# Altium schematic sheet cube.SchDoc
size A4
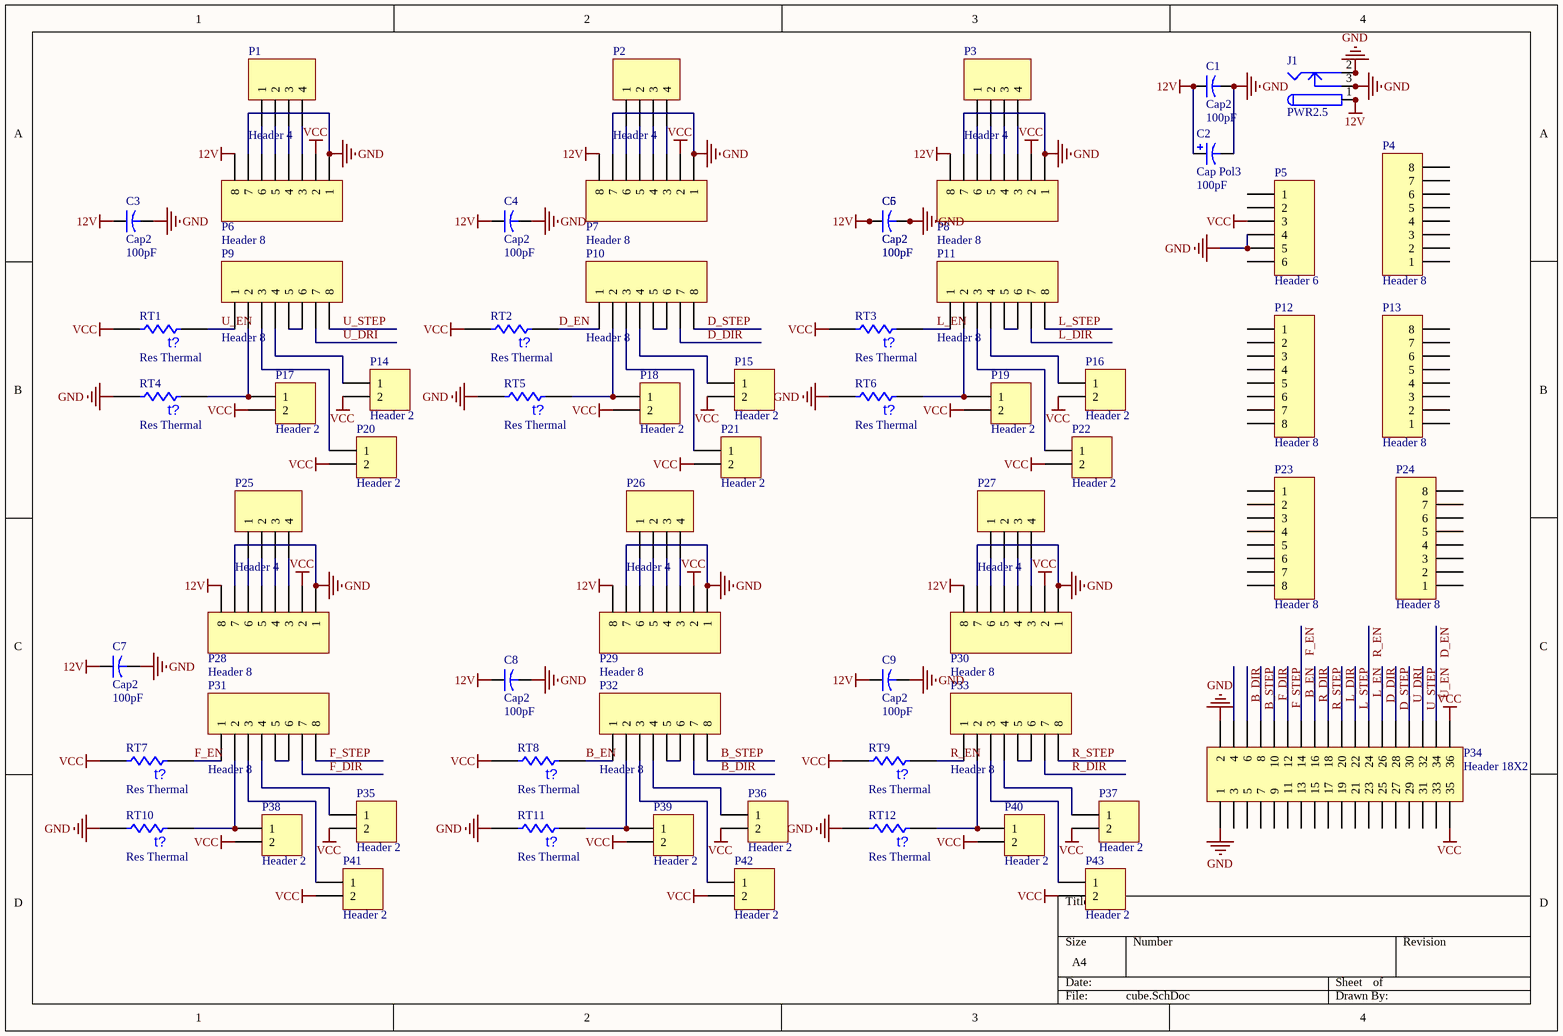
[diagram p0: cube.SchDoc]

## Parts
C1  Cap2  value 100pF  [CAPR5-4X5]
C2  Cap Pol3  value 100pF  [1812]
C3  Cap2  value 100pF  [CAPR5-4X5]
C4  Cap2  value 100pF  [CAPR5-4X5]
C5  Cap2  value 100pF  [CAPR5-4X5]
C6  Cap2  value 100pF  [CAPR5-4X5]
C7  Cap2  value 100pF  [CAPR5-4X5]
C8  Cap2  value 100pF  [CAPR5-4X5]
C9  Cap2  value 100pF  [CAPR5-4X5]
J1  PWR2.5  [KLD-0202]
P1  Header 4  [HDR1X4]
P2  Header 4  [HDR1X4]
P3  Header 4  [HDR1X4]
P4  Header 8  [HDR1X8]
P5  Header 6  [HDR1X6]
P6  Header 8  [HDR1X8]
P7  Header 8  [HDR1X8]
P8  Header 8  [HDR1X8]
P9  Header 8  [HDR1X8]
P10  Header 8  [HDR1X8]
P11  Header 8  [HDR1X8]
P12  Header 8  [HDR1X8]
P13  Header 8  [HDR1X8]
P14  Header 2  [HDR1X2]
P15  Header 2  [HDR1X2]
P16  Header 2  [HDR1X2]
P17  Header 2  [HDR1X2]
P18  Header 2  [HDR1X2]
P19  Header 2  [HDR1X2]
P20  Header 2  [HDR1X2]
P21  Header 2  [HDR1X2]
P22  Header 2  [HDR1X2]
P23  Header 8  [HDR1X8]
P24  Header 8  [HDR1X8]
P25  Header 4  [HDR1X4]
P26  Header 4  [HDR1X4]
P27  Header 4  [HDR1X4]
P28  Header 8  [HDR1X8]
P29  Header 8  [HDR1X8]
P30  Header 8  [HDR1X8]
P31  Header 8  [HDR1X8]
P32  Header 8  [HDR1X8]
P33  Header 8  [HDR1X8]
P34  Header 18X2  [HDR2X18]
P35  Header 2  [HDR1X2]
P36  Header 2  [HDR1X2]
P37  Header 2  [HDR1X2]
P38  Header 2  [HDR1X2]
P39  Header 2  [HDR1X2]
P40  Header 2  [HDR1X2]
P41  Header 2  [HDR1X2]
P42  Header 2  [HDR1X2]
P43  Header 2  [HDR1X2]
RT1  Res Thermal  [6-0805_L]
RT2  Res Thermal  [6-0805_L]
RT3  Res Thermal  [6-0805_L]
RT4  Res Thermal  [6-0805_L]
RT5  Res Thermal  [6-0805_L]
RT6  Res Thermal  [6-0805_L]
RT7  Res Thermal  [6-0805_L]
RT8  Res Thermal  [6-0805_L]
RT9  Res Thermal  [6-0805_L]
RT10  Res Thermal  [6-0805_L]
RT11  Res Thermal  [6-0805_L]
RT12  Res Thermal  [6-0805_L]

## Nets
12V: C1.1 C2.1 C3.1 C4.1 C5.1 C6.1 C7.1 C8.1 C9.1 J1.1 J1.1A J1.1B P6.8 P7.8 P8.8 P28.8 P29.8 P30.8
GND: C1.2 C2.2 C3.2 C4.2 C5.2 C6.2 C7.2 C8.2 C9.2 J1.2 J1.2A J1.2B J1.3 J1.3A J1.3B P5.4 P5.5 P6.1 P6.7 P7.1 P7.7 P8.1 P8.7 P28.1 P28.7 P29.1 P29.7 P30.1 P30.7 P34.1 P34.2 RT4.2 RT5.2 RT6.2 RT10.2 RT11.2 RT12.2
VCC: P5.3 P6.2 P7.2 P8.2 P14.2 P15.2 P16.2 P17.2 P18.2 P19.2 P20.2 P21.2 P22.2 P28.2 P29.2 P30.2 P34.35 P34.36 P35.2 P36.2 P37.2 P38.2 P39.2 P40.2 P41.2 P42.2 P43.2 RT1.2 RT2.2 RT3.2 RT7.2 RT8.2 RT9.2
B_DIR: P32.7 P34.6
B_EN: P31.1 P32.1 P34.14 RT7.1 RT8.1  [also labelled F_EN]
B_STEP: P32.8 P34.8
D_DIR: P10.7 P34.26
D_EN: P9.1 P10.1 P34.34 RT1.1 RT2.1  [also labelled U_EN]
D_STEP: P10.8 P34.28
F_DIR: P31.7 P34.10
F_STEP: P31.8 P34.12
L_DIR: P11.7 P34.20
L_EN: P11.1 P33.1 P34.24 RT3.1 RT9.1  [also labelled R_EN]
L_STEP: P11.8 P34.22
R_DIR: P33.7 P34.16
R_STEP: P33.8 P34.18
U_DRI: P9.7 P34.30
U_STEP: P9.8 P34.32
NetP1_1: P1.1 P6.6
NetP1_2: P1.2 P6.5
NetP1_3: P1.3 P6.4
NetP1_4: P1.4 P6.3
NetP2_1: P2.1 P7.6
NetP2_2: P2.2 P7.5
NetP2_3: P2.3 P7.4
NetP2_4: P2.4 P7.3
NetP3_1: P3.1 P8.6
NetP3_2: P3.2 P8.5
NetP3_3: P3.3 P8.4
NetP3_4: P3.4 P8.3
NetP9_2: P9.2 P17.1 RT4.1
NetP9_3: P9.3 P20.1
NetP9_4: P9.4 P14.1
NetP9_5: P9.5 P9.6
NetP10_2: P10.2 P18.1 RT5.1
NetP10_3: P10.3 P21.1
NetP10_4: P10.4 P15.1
NetP10_5: P10.5 P10.6
NetP11_2: P11.2 P19.1 RT6.1
NetP11_3: P11.3 P22.1
NetP11_4: P11.4 P16.1
NetP11_5: P11.5 P11.6
NetP25_1: P25.1 P28.6
NetP25_2: P25.2 P28.5
NetP25_3: P25.3 P28.4
NetP25_4: P25.4 P28.3
NetP26_1: P26.1 P29.6
NetP26_2: P26.2 P29.5
NetP26_3: P26.3 P29.4
NetP26_4: P26.4 P29.3
NetP27_1: P27.1 P30.6
NetP27_2: P27.2 P30.5
NetP27_3: P27.3 P30.4
NetP27_4: P27.4 P30.3
NetP31_2: P31.2 P38.1 RT10.1
NetP31_3: P31.3 P41.1
NetP31_4: P31.4 P35.1
NetP31_5: P31.5 P31.6
NetP32_2: P32.2 P39.1 RT11.1
NetP32_3: P32.3 P42.1
NetP32_4: P32.4 P36.1
NetP32_5: P32.5 P32.6
NetP33_2: P33.2 P40.1 RT12.1
NetP33_3: P33.3 P43.1
NetP33_4: P33.4 P37.1
NetP33_5: P33.5 P33.6

Not connected (* = marked no-connect by the designer): P4 1 2 3 4 5 6 7 8; P5 1 2 6; P12 1 2 3 4 5 6 7 8; P13 1 2 3 4 5 6 7 8; P23 1 2 3 4 5 6 7 8; P24 1 2 3 4 5 6 7 8; P34 3 4 5 7 9 11 13 15 17 19 21 23 25 27 29 31 33

## Notes on the sheet
- (in symbol Res Thermal) t?

## Library data of the parts
C1 C3-C9 = Cap2: Capacitor; Published: 23-Sep-2002; PackageReference: CAPR5-4X5; Publisher: Altium Limited; PackageDescription: Capacitor; 2 Leads
C2 = Cap Pol3: Polarized Capacitor (Surface Mount); Published: 8-Jun-2000; LatestRevisionDate: 29-May-2009; LatestRevisionNote: IPC-7351 Footprint Added.; PackageReference: C0805; Publisher: Altium Limited; PackageDescription: Chip Capacitor
J1 = PWR2.5: Low Voltage Power Supply Connector; Published: 17-Dec-2003; DatasheetDocument: 09-May-2002; Publisher: Altium Limited; ComponentLink1Description: Manufacturer Link; ComponentLink1URL: http://domino.kycon.com/internet/Products.html
P1-P3 P25-P27 = Header 4: Header, 4-Pin; LatestRevisionDate: 17-Jul-2002; LatestRevisionNote: Re-released for DXP Platform.; Publisher: Altium Limited
P4 P6-P13 P23 P24 P28-P33 = Header 8: Header, 8-Pin; LatestRevisionDate: 17-Jul-2002; LatestRevisionNote: Re-released for DXP Platform.; Publisher: Altium Limited
P5 = Header 6: Header, 6-Pin; LatestRevisionDate: 17-Jul-2002; LatestRevisionNote: Re-released for DXP Platform.; Publisher: Altium Limited
P14-P22 P35-P43 = Header 2: Header, 2-Pin; LatestRevisionDate: 17-Jul-2002; LatestRevisionNote: Re-released for DXP Platform.; Publisher: Altium Limited
P34 = Header 18X2: Header, 18-Pin, Dual row; LatestRevisionDate: 17-Jul-2002; LatestRevisionNote: Re-released for DXP Platform.; Publisher: Altium Limited
RT1-RT12 = Res Thermal: Thermistor; Published: 24-Mar-1999; LatestRevisionDate: 29-May-2009; LatestRevisionNote: IPC-7351 Footprint Added.; PackageVersion: Mar-2003; PackageReference: 6-0805; Publisher: Altium Limited; PackageDescription: Chip Resistor 0805 Case Size; Code_IPC: RESC2012